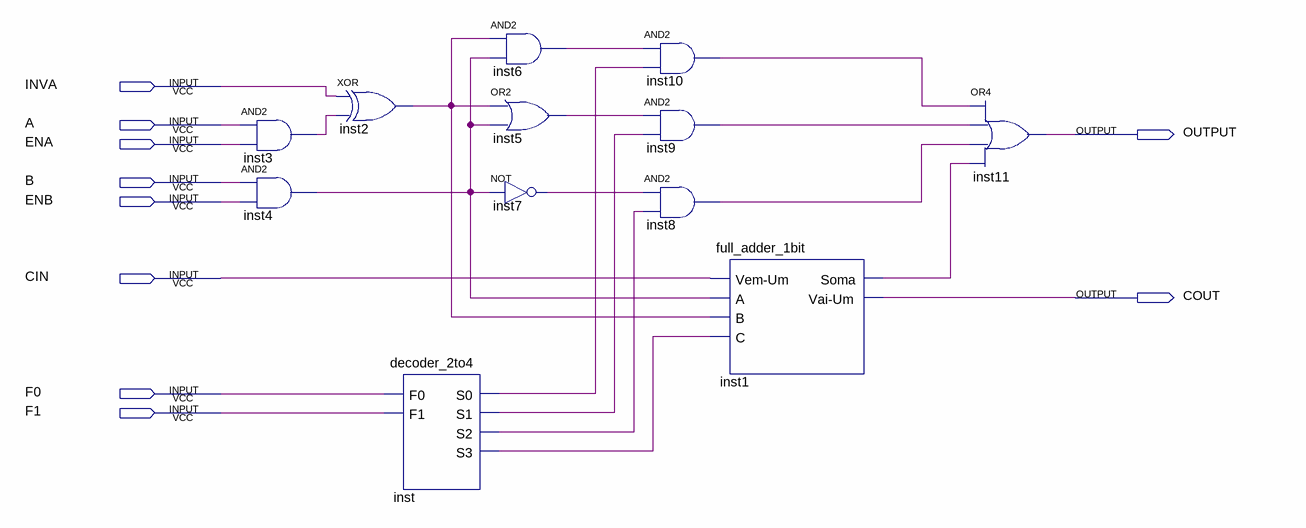
[diagram p0: schematic sheet]
// Quartus schematic ULA_1bit.bdf as structural Verilog: 12 symbols, 10 pins
module ULA_1bit (
  input  INVA,
  input  A,
  input  ENA,
  input  B,
  input  ENB,
  input  CIN,
  input  F0,
  input  F1,
  output OUTPUT,
  output COUT
);

  wire inst1_soma, inst2_out, inst3_out, inst4_out, inst5_out, inst6_out, inst7_out, inst8_out, inst9_out,
       inst10_out, inst_s0, inst_s1, inst_s2, inst_s3;

  and inst3 (inst3_out, A, ENA);
  and inst4 (inst4_out, B, ENB);
  xor inst2 (inst2_out, INVA, inst3_out);
  decoder_2to4 inst (.F0(F0), .F1(F1), .S3(inst_s3), .S2(inst_s2), .S1(inst_s1), .S0(inst_s0));
  and inst6 (inst6_out, inst2_out, inst4_out);
  or inst5 (inst5_out, inst2_out, inst4_out);
  not inst7 (inst7_out, inst4_out);
  and inst10 (inst10_out, inst6_out, inst_s0);
  and inst9 (inst9_out, inst5_out, inst_s1);
  and inst8 (inst8_out, inst7_out, inst_s2);
  full_adder_1bit inst1 (.\Vem-Um (CIN), .A(inst4_out), .B(inst2_out), .C(inst_s3), .Soma(inst1_soma), .\Vai-Um (COUT));
  or inst11 (OUTPUT, inst10_out, inst9_out, inst8_out, inst1_soma);
endmodule
